# EAGLE design ScreenbreakOut (EAGLE 9.6.2)
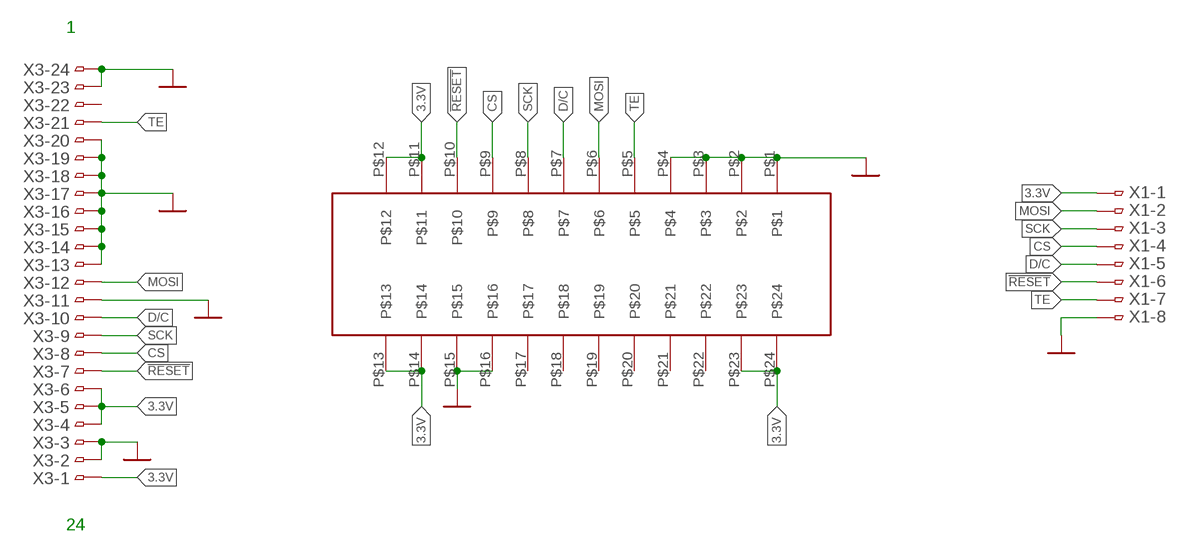
[diagram p0: schematic, sheet 1]

## Parts
U$1  CICULARSCREENRELATED_OK-14F24-04  [CICULARSCREENRELATED_OK-14F24-04]
X1  SCREENBREAKOUT_LEDMATRIXFPCCONNECTOR_CON-HIROSE_FH12-08S-1SH  [SCREENBREAKOUT_LEDMATRIXFPCCONNECTOR_CON-HIROSE_FH12-08S-1SH]
X3  CON-HIROSE_FH12-24S-0.5SH  [CON-HIROSE_FH12-24S-0.5SH]

## Nets
3.3V: U$1.P$11 U$1.P$12 U$1.P$13 U$1.P$14 U$1.P$23 U$1.P$24 X1.1 X3.1 X3.4 X3.5 X3.6
!RESET: U$1.P$10 X1.6 X3.7
CS: U$1.P$9 X1.4 X3.8
D/C: U$1.P$7 X1.5 X3.10
GND: U$1.P$1 U$1.P$2 U$1.P$3 U$1.P$4 U$1.P$15 U$1.P$16 X1.8 X3.2 X3.3 X3.11 X3.13 X3.14 X3.15 X3.16 X3.17 X3.18 X3.19 X3.20 X3.23 X3.24 ; supply symbol labelled SCREENBREAKOUT_3-5-PIN-SMD_GND
MOSI: U$1.P$6 X1.2 X3.12
SCK: U$1.P$8 X1.3 X3.9
TE: U$1.P$5 X1.7 X3.21
Unconnected: U$1.P$17 U$1.P$18 U$1.P$19 U$1.P$20 U$1.P$21 U$1.P$22 X3.22

## Notes on the sheet
- 1
- 24

## Library data of the parts
U$1 = ScreenbreakOut:CICULARSCREENRELATED_OK-14F24-04
X1 = ScreenbreakOut:SCREENBREAKOUT_LEDMATRIXFPCCONNECTOR_CON-HIROSE_FH12-08S-1S: 1mm Pitch Connectors For FPC/FFC Source: Data sheet <http://www.hirose.co.jp/cataloge_hp/e58605370.pdf>; OC_FARNELL: unknown; OC_NEWARK: unknown
X3 = ScreenbreakOut:CON-HIROSE_FH12-24S-0.5S: 0.5mm Pitch Connectors For FPC/FFC Source: Data sheet <http://www.hirose.co.jp/cataloge_hp/e58605370.pdf>; MPN: FH12-24S-0.5SH(55); OC_FARNELL: 1324552; OC_NEWARK: 34M6170

## Board
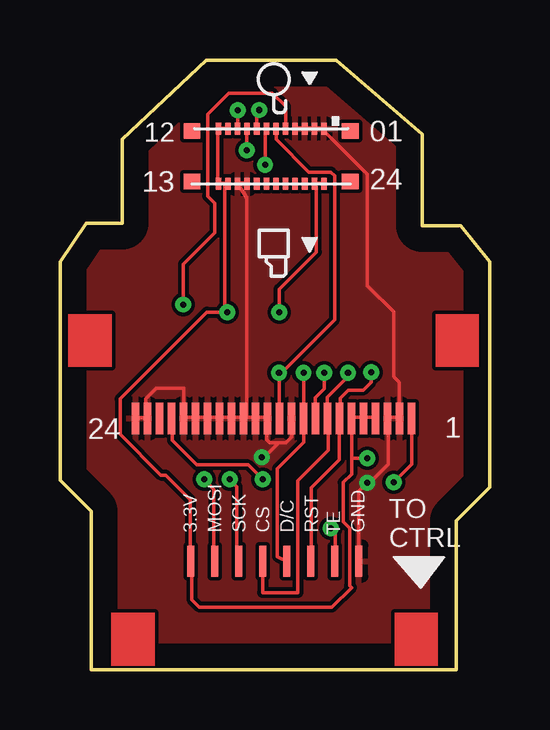
[diagram p1: board, top side]
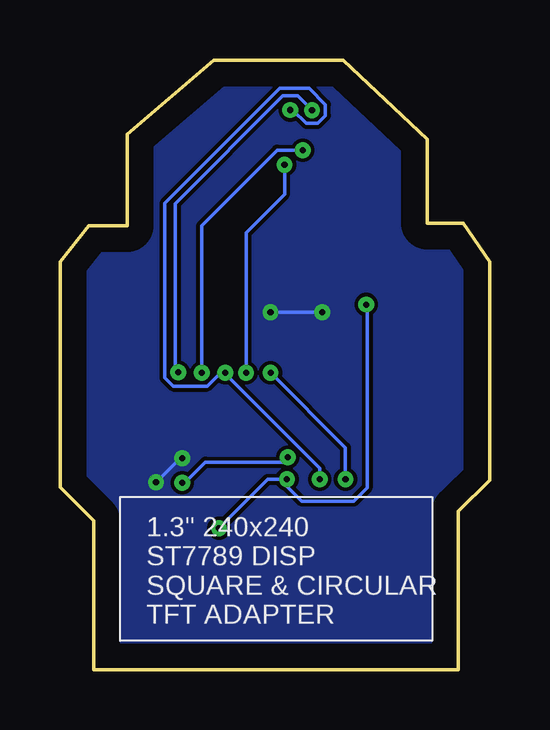
[diagram p2: board, bottom side, seen from below]

Size 17.9 x 25.4 mm. Coordinates in mm from the lower left corner, seen from the top.
Outline: 0,17 0,7.9 1.3,6.6 1.3,0 16.5,0 16.5,6.2 17.9,7.6 17.9,17 16.7,18.5 15.1,18.5 15.1,22.3 11.5,25.4 6.1,25.4 2.6,22.1 2.6,18.6 1.1,18.6 0,17
Copper layers (1*16): Top 0.035mm / dielectric 1.5mm / Bottom 0.035mm
Design rules "default *": minimum track width 6mil, minimum drill 0.35mm, track to track 6mil, track to pad 6mil, pad to pad 6mil, via to via 6mil, smd to smd 6mil, copper to edge 40mil, drill to drill 6mil, minimum pad ring 10mil, minimum via ring 8mil, stop-mask expansion 4mil, vias tented up to drill 10mil, thermal gap 10mil

### Footprints (pad centres in the part's own frame; a part is rotated, then mirrored left to right if it is on the bottom)
CICULARSCREENRELATED_OK-14F24-04 = smd 0.23 x 0.5: P$1 2.2,1.2; P$2 1.8,1.2; P$3 1.4,1.2; P$4 1,1.2; P$5 0.6,1.2; P$6 0.2,1.2; P$7 -0.2,1.2; P$8 -0.6,1.2; P$9 -1,1.2; P$10 -1.4,1.2; P$11 -1.8,1.2; P$12 -2.2,1.2; P$13 -2.2,-1.1; P$14 -1.8,-1.1; P$15 -1.4,-1.1; P$16 -1,-1.1; P$17 -0.6,-1.1; P$18 -0.2,-1.1; P$19 0.2,-1.1; P$20 0.6,-1.1; P$21 1,-1.1; P$22 1.4,-1.1; P$23 1.8,-1.1; P$24 2.2,-1.1 | smd 0.7 x 0.65: P$25 -3.3,1.1; P$26 -3.3,-1; P$27 3.3,-1; P$28 3.3,1.1
SCREENBREAKOUT_LEDMATRIXFPCCONNECTOR_CON-HIROSE_FH12-08S-1SH = smd 0.3 x 1.3: 1 -3.5,3.25; 2 -2.5,3.25; 3 -1.5,3.25; 4 -0.5,3.25; 5 0.5,3.25; 6 1.5,3.25; 7 2.5,3.25; 8 3.5,3.25
CON-HIROSE_FH12-24S-0.5SH = smd 0.3 x 1.3: 1 -5.75,3.25; 2 -5.25,3.25; 3 -4.75,3.25; 4 -4.25,3.25; 5 -3.75,3.25; 6 -3.25,3.25; 7 -2.75,3.25; 8 -2.25,3.25; 9 -1.75,3.25; 10 -1.25,3.25; 11 -0.75,3.25; 12 -0.25,3.25; 13 0.25,3.25; 14 0.75,3.25; 15 1.25,3.25; 16 1.75,3.25; 17 2.25,3.25; 18 2.75,3.25; 19 3.25,3.25; 20 3.75,3.25; 21 4.25,3.25; 22 4.75,3.25; 23 5.25,3.25; 24 5.75,3.25

### Placement (x,y rotation side)
U$1  8.8,21.34 0 top
X1  8.94,1.27 0 top
X3  8.9,13.72 180 top

### Tracks (layer width: path | path; a pad name or v marks a point on that pad's centre or on a via)
3.3V  (via drill 0.25)
  Top 0.152: 13.22,10.36 X3.4 13.06,10.52 12.7,10.52 | U$1.P$24 10.98,20.27 10.68,20.27 U$1.P$23 10.68,20.12 10.68,17.4 9.13,15.85 v9.13,14.9 | 6.87,20.27 7.02,20.27 U$1.P$14 | 6.87,20.27 6.56,20.27 | U$1.P$11 7.02,22.55 6.56,22.55 U$1.P$12 6.56,22.4 6.56,20.27 | 6.56,20.27 U$1.P$13 | 6.87,20.27 6.87,15 v6.97,14.9 6.12,14.9 2.5,11.28 2.5,9.8 4.2,8.1 4.4,8.1 5.42,7.08 5.42,4.55 X1.1 5.49,4.47 5.49,2.92 5.81,2.6 11.33,2.6 12.15,3.42 12.07,3.5 12.07,5.89 11.8,6.16 11.8,7.8 12.15,8.15 12.15,8.8 | 12.76,10.52 X3.5 | X3.6 | 12.61,10.52 X3.5 | X3.6 12.15,10.52 12.7,10.52 | X3.6 12.15,8.8 | X3.5 12.7,10.52 | 14.59,10.36 X3.1 14.65,8.55 v13.9,7.8 | v12.8,8.8 12.15,8.8
  Bottom 0.152: v9.13,14.9 v6.97,14.9 | v13.9,7.8 12.9,8.8 v12.8,8.8
  pour Bottom: -1.6,26.6 -1.6,-1 19.9,-1 19.9,27 17.7,27 -1.6,27
!RESET  (via drill 0.25)
  Top 0.152: X1.6 10.47,4.54 10.47,7.58 11.64,8.75 11.64,10.46 X3.7 11.67,10.49 11.67,11.31 12,11.64 12.63,11.64 12.97,11.98 v12.97,12.39 | U$1.P$10 7.4,23.4 v7.4,23.31
  Bottom 0.152: v7.4,23.31 8,23.91 8.61,23.91 13.1,19.42 13.1,12.52 v12.97,12.39
CS  (via drill 0.25)
  Top 0.152: 11.08,10.52 X3.8 | v7.78,21.64 7.78,22.4 U$1.P$9 | v12,12.37 12,12.22 11.14,11.35 11.14,10.47 X3.8 | X1.4 8.44,3.21 9.91,3.21 9.91,7.88 11.18,9.15 11.18,10.43 X3.8
  Bottom 0.152: v7.78,21.64 8.85,21.64 12,18.49 v12,12.37
D/C  (via drill 0.25)
  Top 0.152: v8.54,21.03 8.54,22.4 U$1.P$7 | v10.15,12.37 X3.10 10.15,9.47 9.05,8.38 9.05,4.71 X1.5
  Bottom 0.152: v8.54,21.03 8.54,19.81 10.15,18.21 v10.15,12.37
GND  (via drill 0.25)
  Top 0.152: 5.14,10.36 X3.20 | 3.16,10.52 X3.24 3.18,10.5 3.57,10.5 | 3.62,10.52 X3.23 3.57,10.5 | 3.57,10.5 3.57,11.28 4.02,11.73 5.15,11.73 X3.20 | 5.6,10.52 6.05,10.52 X3.18 | 5.75,10.52 X3.19 5.6,10.52 | 6.31,10.52 6.21,10.52 X3.18 | 6.51,10.52 X3.17 6.66,10.52 | X3.20 5.29,10.52 5.6,10.52 | U$1.P$16 7.78,20.27 7.48,20.27 U$1.P$15 7.78,19.66 7.78,10.6 X3.15 | X3.14 8.03,10.52 7.27,10.52 X3.16 7.12,10.52 6.2,10.52 X3.18 | 7.73,10.52 X3.15 | 8.19,10.52 8.44,10.52 | 8.19,10.52 X3.14 | X3.11 9.66,10.46 9.66,9.7 9.41,9.45 9.11,9.45 | 9.11,9.45 8.41,8.75 v8.41,8.84 | 9.11,9.45 8.75,9.45 8.61,9.58 X3.13 8.64,10.52 8.2,10.52 X3.14 | 10.22,22.55 9.76,22.55 U$1.P$4 | 10.22,22.55 10.53,22.55 U$1.P$2 10.68,22.55 10.98,22.55 U$1.P$1 11,22.44 12.8,20.64 12.8,16 13.9,14.9 13.9,12.2 14.13,11.97 14.13,10.52 | 10.22,22.55 U$1.P$3 | v12.8,7.78 12.9,7.78 13.67,8.55 13.67,10.44 X3.3 | v12.8,7.78 12.7,7.68 | 13.97,10.52 13.67,10.52 X3.3 | 14.13,10.52 X3.2 | X3.3 13.7,10.52 14.13,10.52 | X3.15 7.7,10.52 8.19,10.52 | v12.8,7.78 12.44,7.42 X1.8
  Bottom 0.152: v8.41,8.84 8.61,8.64 11.84,8.64 12.7,7.78 v12.8,7.78
  pour Top: -2.6,28 -2.6,-2.7 20.9,-2.7 20.9,28.5 20,28.5 -2.6,28.5 -2.6,28.1
MOSI  (via drill 0.25)
  Top 0.152: 9.1,10.52 X3.12 9.13,10.49 v9.13,12.37 9.23,12.37 11.44,14.58 11.44,20.57 11.29,20.73 10.37,20.73 9,22.1 9,22.4 U$1.P$6 | v6.01,7.92 6.41,7.53 6.41,4.95 6.41,4.96 6.44,4.92 X1.2
  Bottom 0.152: v6.01,7.92 6.01,9.25 v9.13,12.37
SCK  (via drill 0.25)
  Top 0.152: 7.42,4.42 X1.3 7.44,4.9 7.37,4.93 7.37,7.62 v7.07,7.92 | 10.62,10.36 X3.9 10.62,10.52 10.62,11.32 11.01,11.71 v11.01,12.37 | U$1.P$8 8.2,23.2 8.3,23.3 v8.3,23.32
  Bottom 0.152: v7.07,7.92 7.07,8.38 11.01,12.32 v11.01,12.37 11.21,12.37 11.77,11.81 13.18,11.81 13.53,12.16 13.53,19.43 8.74,24.21 7.51,24.21 6.84,23.55 6.84,23.08 7.17,22.75 7.63,22.75 8.19,23.32 v8.3,23.32
TE  (via drill 0.25)
  Top 0.152: X3.21 4.68,10.43 4.68,9.55 5.7,8.53 7.83,8.53 v8.44,7.92 | X1.7 11.48,4.55 11.48,5.69 v11.28,5.89 | U$1.P$5 9.4,23.47 8.85,24.02 7.03,24.02 6.15,23.14 6.15,19.73 6.45,19.43 6.45,18.2 5.14,16.89 v5.14,15.21
  Bottom 0.152: v11.28,5.89 9.24,7.92 v8.44,7.92 8.44,7.64 7.82,7.02 5.65,7.02 5.1,7.57 5.1,15.17 v5.14,15.21

### Text on the board
tPlace: 12 | 01 | 13 | 24 | 24 | 1 | 3.3V | MOSI | SCK | CS | D/C | RST | TE | GND | TO / CTRL
bPlace: 1.3" 240x240 / ST7789 DISP / SQUARE & CIRCULAR / TFT ADAPTER